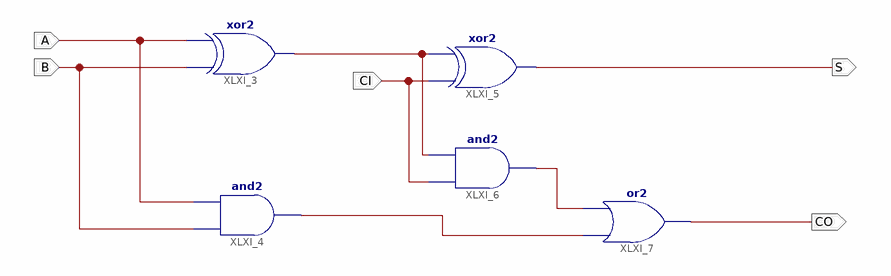
[diagram p0: schematic sheet 1]
// Xilinx ISE schematic full_adder.sch (spartan3e) as structural Verilog: 5 symbols, 5 ports
module full_adder (
  input  CI,
  input  A,
  input  B,
  output S,
  output CO
);

  wire XLXN_6, XLXN_8, XLXN_10;

  xor XLXI_3 (XLXN_6, B, A);
  and XLXI_4 (XLXN_10, B, A);
  xor XLXI_5 (S, CI, XLXN_6);
  and XLXI_6 (XLXN_8, CI, XLXN_6);
  or XLXI_7 (CO, XLXN_10, XLXN_8);
endmodule
